# EAGLE schematic PulseFit (EAGLE 8.3.2)
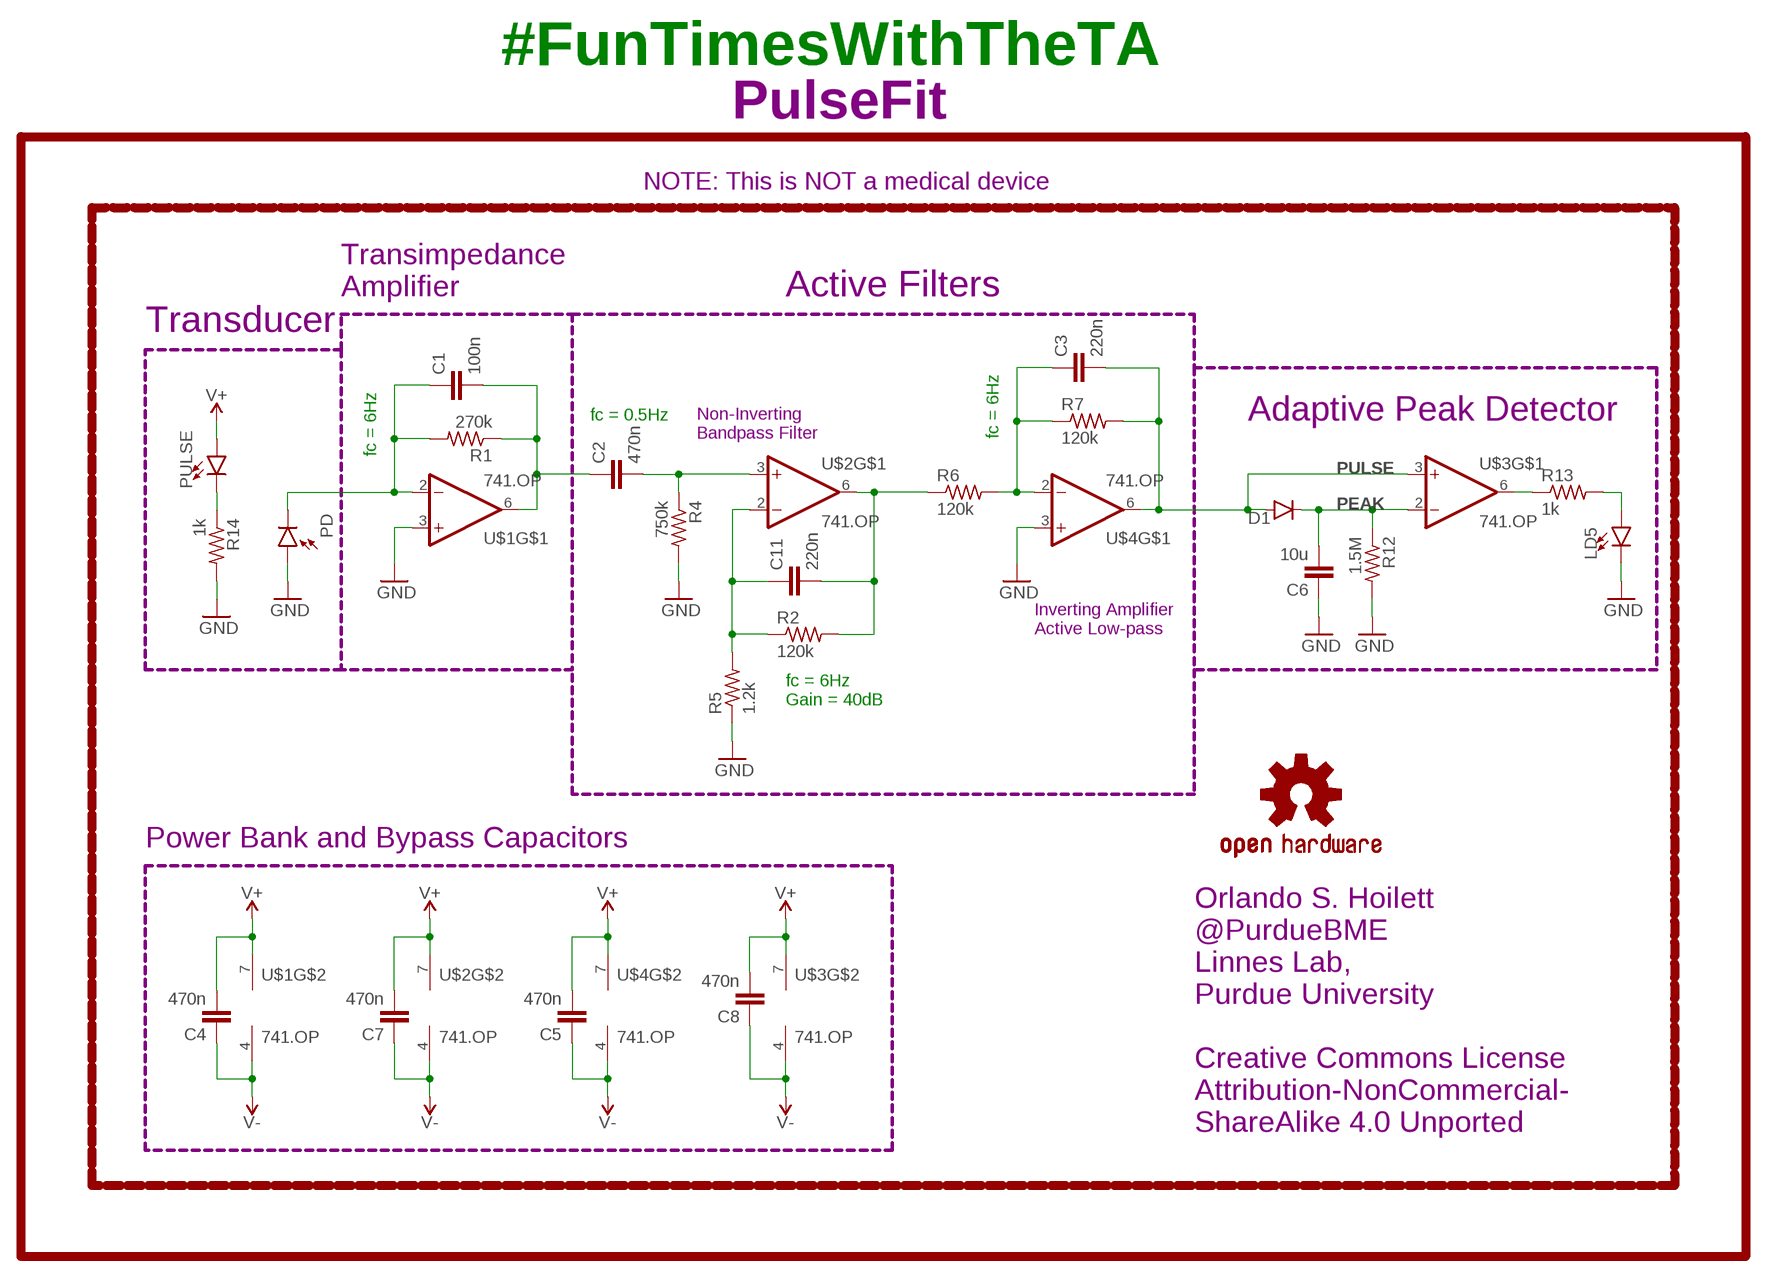
[diagram p0: schematic, sheet 1]

## Parts
C1  100n  C-EUC0402  [C0402]
C2  470n  C-EUC0402  [C0402]
C3  220n  C-EUC0402  [C0402]
C4  470n  C-EUC0402  [C0402]
C5  470n  C-EUC0402  [C0402]
C6  10u  C-EUC0805  [C0805]
C7  470n  C-EUC0402  [C0402]
C8  470n  C-EUC0402  [C0402]
C11  220n  C-EUC0402  [C0402]
D1  250mA/100V  DIODEBAS16  [SOD-323]
LD5  LED5MM  [LED_5MM]
LOGO1  OSHW-LOGOS  [OSHW-LOGO-S]
PD  PHOTODIODE-5MM  [PD_5MM]
PULSE  LED5MM  [LED_5MM]
R1  270k  R-US_R0402  [R0402]
R2  120k  R-US_R0402  [R0402]
R4  750k  R-US_R0402  [R0402]
R5  1.2k  R-US_R0402  [R0402]
R6  120k  R-US_R0402  [R0402]
R7  120k  R-US_R0402  [R0402]
R12  1.5M  R-US_R0402  [R0402]
R13  1k  R-US_R0402  [R0402]
R14  1k  R-US_R0402  [R0402]
U$1  741.OP  [DIL08]
U$2  741.OP  [DIL08]
U$3  741.OP  [DIL08]
U$4  741.OP  [DIL08]

## Nets
COMP: R13.1 U$3.6(OUT)
GND: C6.1 LD5.K(C) PD.A R4.2 R5.1 R12.2 R14.2 U$1.3(+IN) U$4.3(+IN)
N$1: C1.1 PD.K(C) R1.2 U$1.2(-IN)
N$2: C1.2 C2.1 R1.1 U$1.6(OUT)
N$4: C2.2 R4.1 U$2.3(+IN)
N$6: C3.1 R6.2 R7.1 U$4.2(-IN)
N$7: LD5.A R13.2
N$9: PULSE.K(C) R14.1
N$10: C11.1 R2.1 R5.2 U$2.2(-IN)
PEAK: C6.2 D1.C R12.1 U$3.2(-IN)
PULSE: C3.2 C11.2 D1.A R2.2 R6.1 R7.2 U$2.6(OUT) U$3.3(+IN) U$4.6(OUT)
V+: C4.2 C5.2 C7.2 C8.2 PULSE.A U$1.7(V+) U$2.7(V+) U$3.7(V+) U$4.7(V+)
VDD: C4.1 C5.1 C7.1 C8.1 U$1.4(V-) U$2.4(V-) U$3.4(V-) U$4.4(V-) ; supply symbol labelled V-

## Notes on the sheet
- #FunTimesWithTheTA
- PulseFit
- NOTE: This is NOT a medical device
- Transimpedance
  Amplifier
- Active Filters
- Transducer
- fc = 0.5Hz | Adaptive Peak Detector
- Non-Inverting
  Bandpass Filter
- fc = 6Hz
- fc = 6Hz
- Inverting Amplifier
  Active Low-pass
- fc = 6Hz
  Gain = 40dB
- Power Bank and Bypass Capacitors
- Orlando S. Hoilett
  @PurdueBME
  Linnes Lab,
  Purdue University
  
  Creative Commons License
  Attribution-NonCommercial-
  ShareAlike 4.0 Unported

## Library data of the parts
C1-C8 C11 = resistor:C-EU: CAPACITOR, European symbol
D1 = SparkFun-DiscreteSemi:DIODE: Diode These are standard reverse protection diodes and small signal diodes. SMA package can handle up to about 1A. SOD-323 can handle about 200mA. What the SOD-323 package when ordering, there are some mfgs out there that are 5-pin packages.; PROD_ID: DIO-09646
LD5 PULSE = CalvEngIO-LED:LED: LED (Generic) Standard schematic elements and footprints for 5mm, 3mm, 1206, and 0603 sized LEDs. Generic LEDs with no color specified. LTST-C190KGKT: arrow indicates cathode
LOGO1 = SparkFun-Aesthetics:OSHW-LOGO: Open Source Hardware Logo This logo indicates the piece of hardware it is found on incorporates a OSHW license and/or adheres to the definition of open source hardware found here: http://freedomdefined.org/OSHW
PD = CalvEngIO-Sensors:PHOTODIODE
R1 R2 R4-R7 R12-R14 = resistor:R-US_: RESISTOR, American symbol
U$1-U$4 = CalvEngIO-AnalogIC:741.OP